# EAGLE design v2 4 button (EAGLE 9.6.2)
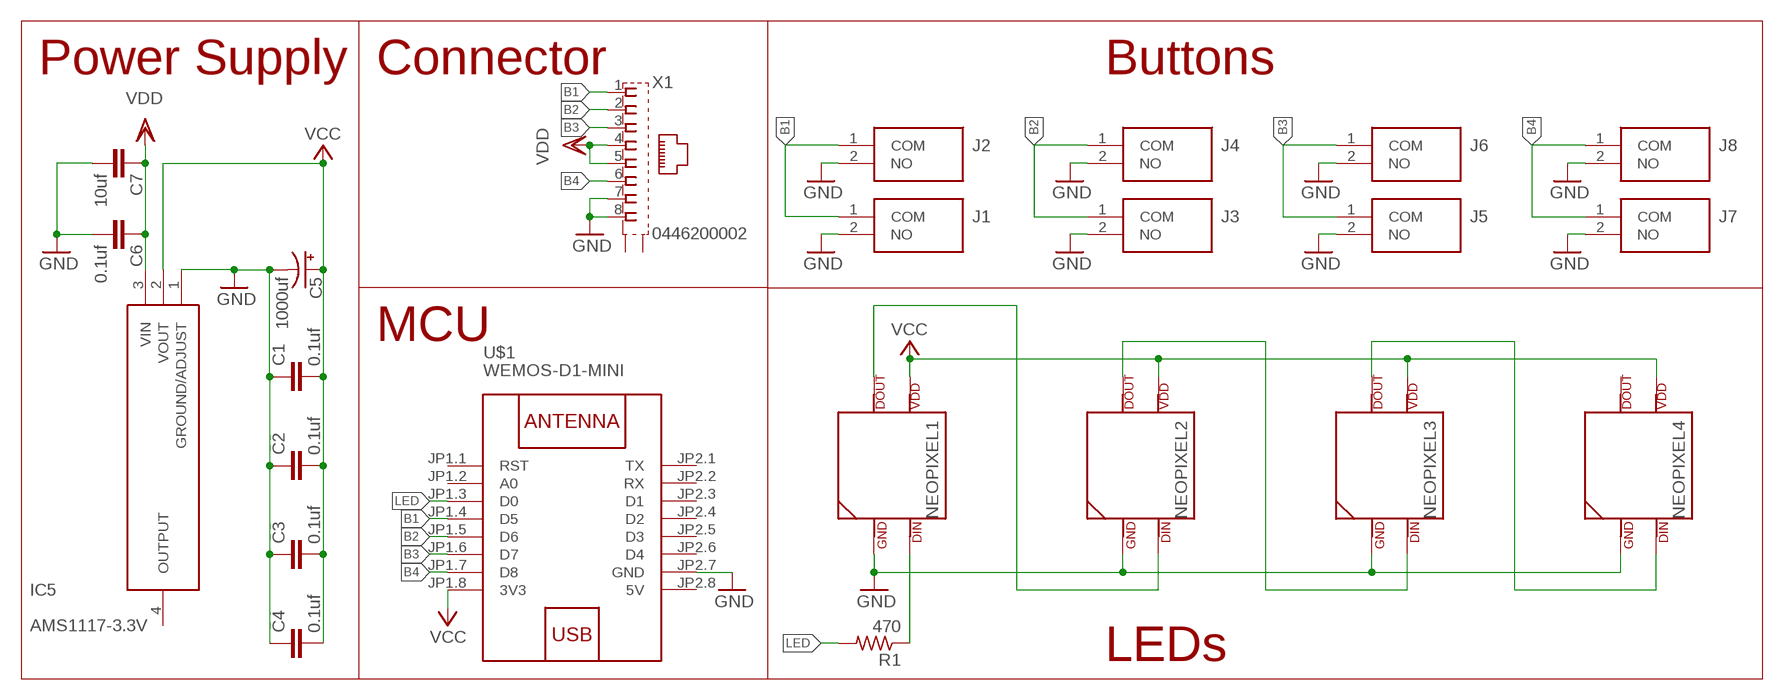
[diagram p0: schematic, sheet 1]

## Parts
C1  0.1uf  C-EUC0603  [C0603]
C2  0.1uf  C-EUC0603  [C0603]
C3  0.1uf  C-EUC0603  [C0603]
C4  0.1uf  C-EUC0603  [C0603]
C5  1000uf  CPOL-USUD-10X10  [UD-10X10_NICHICON]
C6  0.1uf  C-EUC0603  [C0603]
C7  10uf  C-EUC0603  [C0603]
IC5  AMS1117-3.3V  [SOT229P700X180-4N]
J1  PTS636_SM25F_SMTR_LFS  [PTS636SM25FSMTRLFS]
J2  PTS636_SM25F_SMTR_LFS  [PTS636SM25FSMTRLFS]
J3  PTS636_SM25F_SMTR_LFS  [PTS636SM25FSMTRLFS]
J4  PTS636_SM25F_SMTR_LFS  [PTS636SM25FSMTRLFS]
J5  PTS636_SM25F_SMTR_LFS  [PTS636SM25FSMTRLFS]
J6  PTS636_SM25F_SMTR_LFS  [PTS636SM25FSMTRLFS]
J7  PTS636_SM25F_SMTR_LFS  [PTS636SM25FSMTRLFS]
J8  PTS636_SM25F_SMTR_LFS  [PTS636SM25FSMTRLFS]
NEOPIXEL1  SK6812NEOPIXEL5050  [SK6812]
NEOPIXEL2  SK6812NEOPIXEL5050  [SK6812]
NEOPIXEL3  SK6812NEOPIXEL5050  [SK6812]
NEOPIXEL4  SK6812NEOPIXEL5050  [SK6812]
R1  470  R-US_R0603  [R0603]
U$1  WEMOS-D1-MINI  [WEMOS-D1-MINI]
X1  0446200002  [0446200002]

## Nets
B1: J1.1(COM) J2.1(COM) U$1.JP1.4(D5) X1.1
B2: J3.1(COM) J4.1(COM) U$1.JP1.5(D6) X1.2
B3: J5.1(COM) J6.1(COM) U$1.JP1.6(D7) X1.3
B4: J7.1(COM) J8.1(COM) U$1.JP1.7(D8) X1.6
GND: C1.1 C2.1 C3.1 C4.1 C5.- C6.2 C7.2 IC5.1(GROUND/ADJUST) J1.2(NO) J2.2(NO) J3.2(NO) J4.2(NO) J5.2(NO) J6.2(NO) J7.2(NO) J8.2(NO) NEOPIXEL1.3(GND) NEOPIXEL2.3(GND) NEOPIXEL3.3(GND) NEOPIXEL4.3(GND) U$1.JP2.7(GND) X1.7 X1.8
LED: R1.2 U$1.JP1.3(D0)
N$1: NEOPIXEL1.2(DOUT) NEOPIXEL2.4(DIN)
N$2: NEOPIXEL2.2(DOUT) NEOPIXEL3.4(DIN)
N$3: NEOPIXEL3.2(DOUT) NEOPIXEL4.4(DIN)
N$5: NEOPIXEL1.4(DIN) R1.1
VCC: C1.2 C2.2 C3.2 C4.2 C5.+ IC5.2(VOUT) NEOPIXEL1.1(VDD) NEOPIXEL2.1(VDD) NEOPIXEL3.1(VDD) NEOPIXEL4.1(VDD) U$1.JP1.8(3V3)
VDD: C6.1 C7.1 IC5.3(VIN) X1.4 X1.5
Unconnected: IC5.4(OUTPUT) NEOPIXEL4.2(DOUT) U$1.JP1.1(RST) U$1.JP1.2(A0) U$1.JP2.1(TX) U$1.JP2.2(RX) U$1.JP2.3(D1) U$1.JP2.4(D2) U$1.JP2.5(D3) U$1.JP2.6(D4) X1.S@1(S1) X1.S@2(S2)

## Notes on the sheet
- Power Supply | Connector | Buttons
- MCU
- LEDs

## Power pins joined to a net without a drawn wire
5V: U$1.JP2.8(5V)

## Library data of the parts
C1-C4 C6 C7 = rcl:C-EU: CAPACITOR, European symbol; SPICEPREFIX: C
C5 = rcl:CPOL-US: POLARIZED CAPACITOR, American symbol; SPICEPREFIX: C
IC5 = SamacSys_Parts:AMS1117-3.3V: 1A LOW DROPOUT VOLTAGE REGULATOR, SOT-223 Source: Datasheet <http://www.advanced-monolithic.com/pdf/ds1117.pdf>; DESCRIPTION: 1A LOW DROPOUT VOLTAGE REGULATOR, SOT-223; HEIGHT: 1.8mm; MANUFACTURER_NAME: Advanced Monolithic Systems; MANUFACTURER_PART_NUMBER: ams1117-3.3v
J1-J8 = SamacSys_Parts:PTS636_SM25F_SMTR_LFS: Tactile Switches Tact 50mA 12VDC, 6.0x3.5, 2.5mm H, 180gf, F leads, No ground pin, White Actuator Source: Datasheet <https://ms.componentsearchengine.com/Datasheets/1/PTS636 SM25F SMTR LFS.pdf>; ARROW_PART_NUMBER: PTS636 SM25F SMTR LFS; ARROW_PRICE-STOCK: https://www.arrow.com/en/products/pts636-sm25f-smtr-lfs/ck; DESCRIPTION: Tactile Switches Tact 50mA 12VDC, 6.0x3.5, 2.5mm H, 180gf, F leads, No ground pin, White Actuator; HEIGHT: 2.7mm; MANUFACTURER_NAME: C & K COMPONENTS; MANUFACTURER_PART_NUMBER: PTS636 SM25F SMTR LFS; MOUSER_PART_NUMBER: 611-PTS636SM25FSMTRL; MOUSER_PRICE-STOCK: https://www.mouser.co.uk/ProductDetail/CK/PTS636-SM25F-SMTR-LFS?qs=vLWxofP3U2wcBTQSwfMFOw%3D%3D
NEOPIXEL1-NEOPIXEL4 = custom parts:SK6812: for 5050 sk6812 LED
R1 = resistor:R-US_: RESISTOR, American symbol
U$1 = diy-modules:WEMOS-D1-MINI: WEMOS D1 mini: Mini Wi-Fi Board based on ESP-8266 device More details can be found here: https://www.wemos.cc/product/d1-mini.html Click here to find device on ebay.com <http://www.ebay.com/sch/wemos+d1+mini+nodemcu>
X1 = con-molex:0446200002: RJ-45 INVERTED MODULAR JACK ASSEMBLY WITH RJ-11 KEEPOUT FEATURE Source: Data sheet <http://www.farnell.com/datasheets/73207.pdf> MOLEX 0446200002 BUCHSE, RJ45, GESCHIRMT Source: Farnell <http://de.farnell.com/molex/0446200002/buchse-rj45-geschirmt/dp/9251910?ost=9251910>; MF: MOLEX; MPN: 0446200002; OC_FARNELL: 9251910

## Board
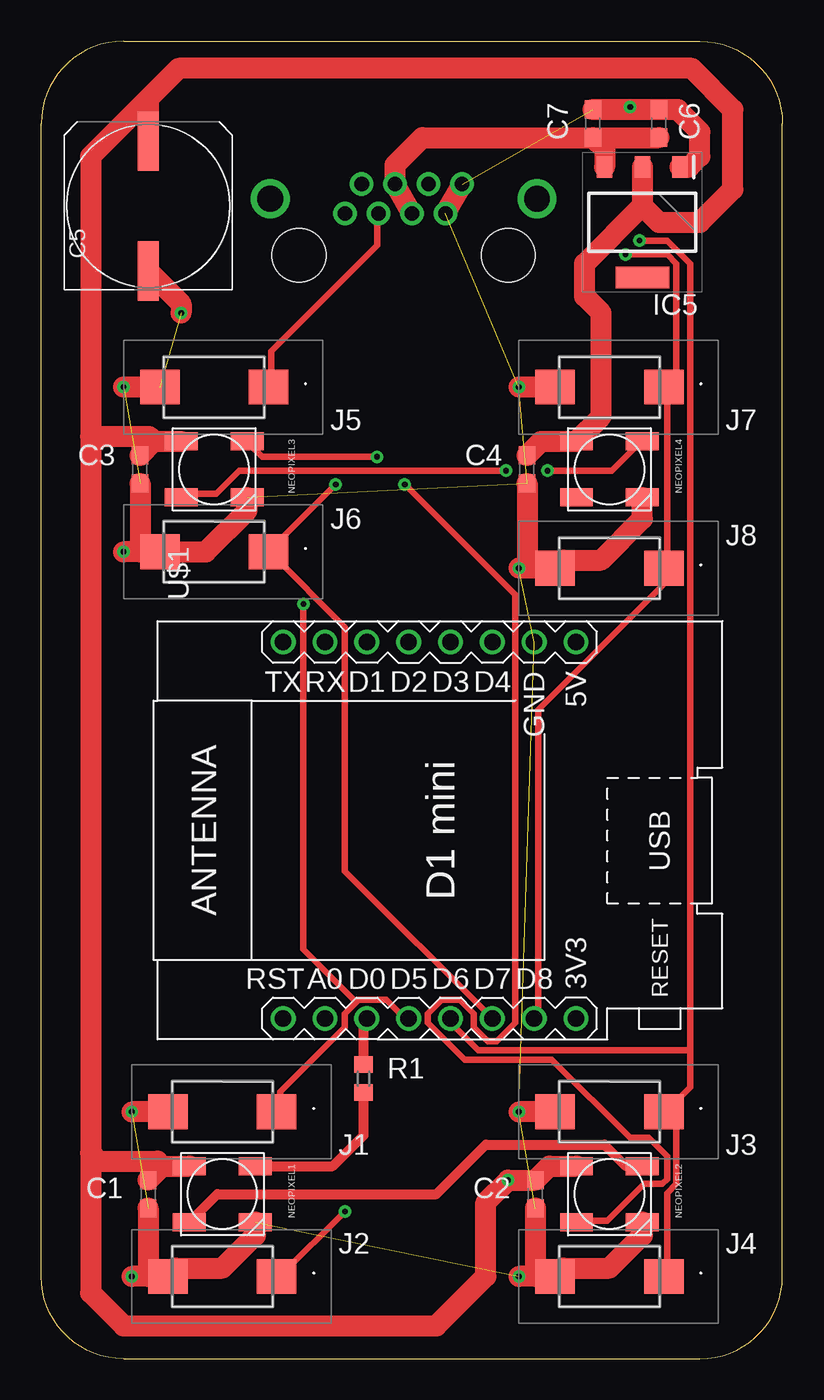
[diagram p1: board, top side]
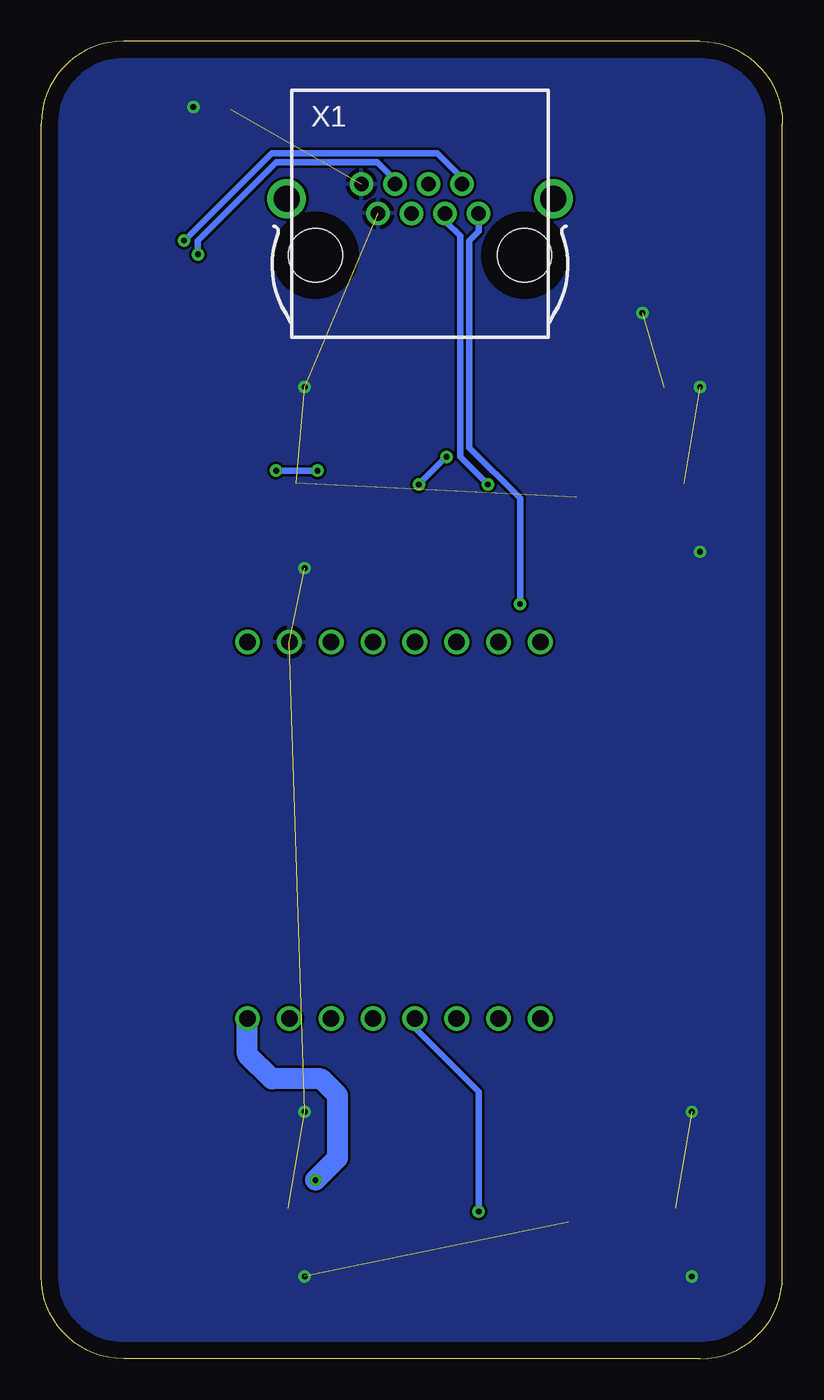
[diagram p2: board, bottom side, seen from below]

Size 45 x 80 mm. Coordinates in mm from the lower left corner, seen from the top.
Outline: 0,5 0,75 arc-90 5,80 40,80 arc-90 45,75 45,5 arc-90 40,0 5,0 arc-90 0,5
Copper layers (1*16): Top 0.035mm / dielectric 1.5mm / Bottom 0.035mm
Design rules "default *": minimum track width 16mil, minimum drill 0.35mm, track to track 6mil, track to pad 6mil, pad to pad 6mil, via to via 6mil, smd to smd 6mil, copper to edge 40mil, drill to drill 6mil, minimum pad ring 10mil, minimum via ring 8mil, stop-mask expansion 4mil, vias tented up to drill 0mil, thermal gap 10mil

### Footprints (pad centres in the part's own frame; a part is rotated, then mirrored left to right if it is on the bottom)
C0603 = smd 1.1 x 1: 1 -0.85,0; 2 0.85,0
UD-10X10_NICHICON = smd 3.6 x 1.3: + 3.925,0; - -3.95,0
SOT229P700X180-4N = smd 1.3 x 0.95: 1 -3.35,2.29; 2 -3.35,0; 3 -3.35,-2.29 | smd 1.3 x 3.25: 4 3.35,0
PTS636SM25FSMTRLFS = smd 2.4 x 2.1: 1 -3.3,0; 2 3.3,0
SK6812 = smd 2 x 1.1: 1 -2,1.7; 2 -2,-1.7; 3 2,-1.7; 4 2,1.7
R0603 = smd 1 x 1.1: 1 -0.85,0; 2 0.85,0
WEMOS-D1-MINI = drill 1: JP1.1 -11.43,9.525; JP1.2 -11.43,6.985; JP1.3 -11.43,4.445; JP1.4 -11.43,1.905; JP1.5 -11.43,-0.635; JP1.6 -11.43,-3.175; JP1.7 -11.43,-5.715; JP1.8 -11.43,-8.255; JP2.1 11.43,9.525; JP2.2 11.43,6.985; JP2.3 11.43,4.445; JP2.4 11.43,1.905; JP2.5 11.43,-0.635; JP2.6 11.43,-3.175; JP2.7 11.43,-5.715; JP2.8 11.43,-8.255
0446200002 = drill 0.889 pad 1.422: 1 3.556,2.54; 2 2.54,4.318; 3 1.524,2.54; 4 0.508,4.318; 5 -0.508,2.54; 6 -1.524,4.318; 7 -2.54,2.54; 8 -3.556,4.318 | drill 1.575 pad 2.286: S@1 -8.103,3.429; S@2 8.103,3.429 | hole 3.251: 6.35,0; -6.35,0

### Placement (x,y rotation side)
C1  6.5,10 90 top
C2  30,10 90 top
C3  6,54 90 top
C4  29.5,54 90 top
C5  6.5,70 90 top
C6  37.5,75 90 top
C7  33.5,75 90 top
IC5  36.5,69 270 top
J1  11,15 180 top
J2  11,5 180 top
J3  34.5,15 180 top
J4  34.5,5 180 top
J5  10.5,59 180 top
J6  10.5,49 180 top
J7  34.5,59 180 top
J8  34.5,48 180 top
NEOPIXEL1  11,10 0 top
NEOPIXEL2  34.5,10 0 top
NEOPIXEL3  10.5,54 0 top
NEOPIXEL4  34.5,54 0 top
R1  19.57,17.01 90 top
U$1  24.22,32.09 90 top
X1  22,67 0 bottom

### Tracks (layer width: path | path; a pad name or v marks a point on that pad's centre or on a via)
B1  (via drill 0.35)
  Top 0.406: v18.44,8.94 14.53,5.03 J2.1 | 19.14,21.65 19.28,21.79 20.95,21.79 22.07,20.68 U$1.JP1.4 | 19.14,21.65 18.44,20.95 18.44,20.12 14.53,16.2 14.53,15.09 J1.1 | v15.93,45.82 15.93,24.87 19.14,21.65
  Bottom 0.406: v18.44,8.94 18.44,16.2 22.35,20.12 22.35,20.4 U$1.JP1.4 | v15.93,45.82 15.93,52.25 19,55.32 19,67.89 18.44,68.45 18.44,69.29 X1.1
B2  (via drill 0.35)
  Top 0.406: J4.1 38,5.03 38,10.06 38.56,10.62 38.56,14.25 38,14.81 J3.1 38,15.09 39.4,16.48 39.4,18.72 | v36.32,67.89 38,67.89 39.4,66.5 39.4,18.72 | 39.4,18.72 26.54,18.72 24.87,20.4 U$1.JP1.5
  Bottom 0.406: v36.32,67.89 31.01,73.2 20.95,73.2 19.56,71.81 19.56,71.53 X1.2
B3  (via drill 0.35)
  Top 0.406: J5.1 13.97,59.23 13.97,61.19 20.4,67.61 20.4,69.29 X1.3 | U$1.JP1.6 27.38,20.68 18.44,29.62 18.44,44.42 13.97,48.9 J6.1 13.97,49.17 v17.88,53.09
  Bottom 0.406: v17.88,53.09 19.56,54.76 19.56,68.17 20.4,69.01 20.4,69.29 X1.3
B4  (via drill 0.35)
  Top 0.406: v35.48,67.06 38,67.06 38.56,66.5 38.56,59.79 38,59.23 J7.1 38,58.95 38,48.06 J8.1 37.72,47.78 37.72,46.94 30.18,39.4 30.18,20.68 U$1.JP1.7
  Bottom 0.406: v35.48,67.06 35.48,67.89 30.73,72.64 24.59,72.64 23.75,71.81 23.75,71.53 X1.6
GND  (via drill 0.35)  (11 unrouted)
  Top 0.406: v35.76,76 35.76,75.85
  Top 1.27: X1.7 X1.8 | IC5.1 39.35,72.35 40,73 40,74.5 38.65,75.85 C6.2 35.76,75.85 C7.2 | J5.2 v5,59 | 6,49 J6.2 10,49 12.5,51.5 NEOPIXEL3.3 | 6,49 v5,49 | J1.2 v5.5,15 | 6.5,5 J2.2 8.2,5.5 11,5.5 13,7.5 NEOPIXEL1.3 | 6.5,5 v5.5,5 | C1.1 6.5,5 | C3.1 6,49 | 30,5 J4.2 31.7,5.5 34.5,5.5 36.5,7.5 NEOPIXEL2.3 | 30,5 v29,5 | C2.1 30,5 | J3.2 v29,15 | 29.5,48 J8.2 31.7,48.5 34,48.5 36.5,51 NEOPIXEL4.3 | 29.5,48 v29,48 | C4.1 29.5,48 | J7.2 v29,59 | C5.- 8.5,64.05 v8.5,63.5
  pour Bottom: 5,80 arc90 0,75 0,5 arc90 5,0 6,0 40,0 arc90 45,5 45,75 arc90 40,80 39,80
LED
  Top 0.61: R1.2 19.57,20.45 U$1.JP1.3
N$1
  Top 0.61: NEOPIXEL1.2 10.7,10 24,10 27,13 34.2,13 35.5,11.7 NEOPIXEL2.4
N$2  (via drill 0.35)
  Top 0.406: v22.07,53.09 28.78,46.38 28.78,20.4 27.66,19.28 27.1,19.28 26.26,20.12 26.26,20.95 25.43,21.79 24.31,21.79 23.47,20.95 23.47,20.4 25.7,18.16 31.01,18.16 35.76,13.41 36.88,13.41 38,12.29 38,10.9 37.72,10.62 36.6,10.62 34.37,8.38 32.69,8.38 NEOPIXEL2.2 | v20.4,54.76 13.41,54.76 12.57,55.6 NEOPIXEL3.4
  Bottom 0.406: v20.4,54.76 v22.07,53.09
N$3  (via drill 0.35)
  Top 0.406: v28.22,53.92 12.01,53.92 10.62,52.53 8.66,52.53 NEOPIXEL3.2 | v30.73,53.92 34.65,53.92 36.32,55.6 NEOPIXEL4.4
  Bottom 0.406: v30.73,53.92 v28.22,53.92
N$5
  Top 0.61: NEOPIXEL1.4 17.7,11.7 19.57,13.57 R1.1
VCC  (via drill 0.35)
  Top 1.27: IC5.2 36.5,70 | 36.5,70 37.5,69 40,69 42,71 42,75.85 39.5,78.35 8.35,78.35 6.5,76.5 | 6.5,76.5 C5.+ | C1.2 7.35,11.7 | 7.35,11.7 NEOPIXEL1.1 | C4.2 30.35,55.7 NEOPIXEL4.1 34,57.2 34,63.5 33,64.5 33,66.5 36.5,70 | C3.2 6.85,55.7 | 6.85,55.7 NEOPIXEL3.1 | NEOPIXEL2.1 30.85,11.7 C2.2 v28.35,10.85 27,9.5 27,5 24,2 5,2 3,4 3,12.5 | 6.85,55.7 6.55,56 3,56 | 7.35,11.7 7.05,12 3.5,12 3,12.5 | 6.5,76.5 3,73 3,56 | 3,56 3,12.5
  Bottom 1.27: v28.35,10.85 27,12.2 27,16 28,17 31,17 32.48,18.48 U$1.JP1.8
VDD
  Top 1.27: X1.5 X1.4 21.49,72.49 23.15,74.15 C7.1 | C7.1 C6.1 | C7.1 34.21,73.44 IC5.3